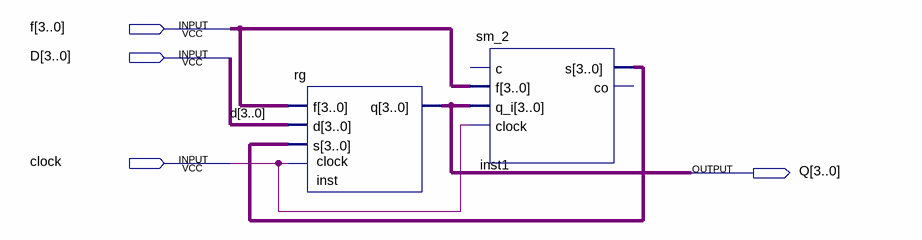
[diagram p0: schematic sheet]
// Quartus schematic rg_sm.bdf as structural Verilog: 2 symbols, 4 pins
module rg_sm (
  input  [3:0] f,
  input  [3:0] D,
  input  clock,
  output [3:0] Q
);

  wire [3:0] inst1_s;

  rg inst (.f(f), .d(D), .s(inst1_s), .clock(clock), .q(Q));
  sm_2 inst1 (.f(f), .q_i(Q), .clock(clock), .s(inst1_s));  // open: c, co
endmodule
